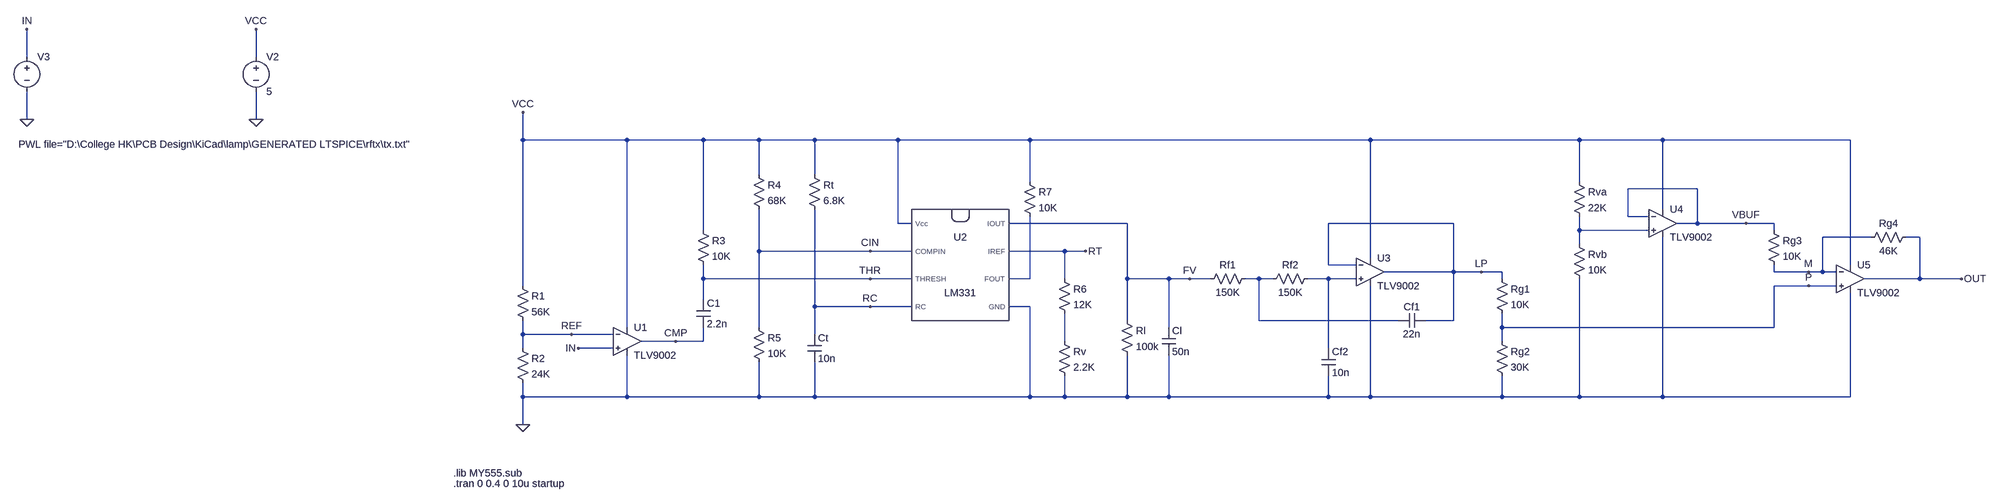
[diagram p0: schematic RX.asc]
RX.asc, the LTspice schematic file:
Version 4.1
SHEET 1 4120 680
WIRE -1040 -464 -1040 -528
WIRE -512 -464 -512 -528
WIRE -1040 -320 -1040 -384
WIRE -512 -320 -512 -384
WIRE 176 -272 176 -336
WIRE 416 -272 176 -272
WIRE 592 -272 416 -272
WIRE 720 -272 592 -272
WIRE 848 -272 720 -272
WIRE 1040 -272 848 -272
WIRE 1344 -272 1040 -272
WIRE 2128 -272 1344 -272
WIRE 2640 -272 2128 -272
WIRE 2832 -272 2640 -272
WIRE 3264 -272 2832 -272
WIRE 720 -192 720 -272
WIRE 848 -192 848 -272
WIRE 1344 -176 1344 -272
WIRE 2640 -176 2640 -272
WIRE 2912 -160 2752 -160
WIRE 2832 -112 2832 -272
WIRE 2752 -96 2752 -160
WIRE 2800 -96 2752 -96
WIRE 1040 -80 1040 -272
WIRE 1072 -80 1040 -80
WIRE 1568 -80 1296 -80
WIRE 2320 -80 2032 -80
WIRE 2912 -80 2912 -160
WIRE 2912 -80 2864 -80
WIRE 3024 -80 2912 -80
WIRE 3088 -80 3024 -80
WIRE 592 -64 592 -272
WIRE 2640 -64 2640 -96
WIRE 2800 -64 2640 -64
WIRE 3088 -64 3088 -80
WIRE 3312 -48 3200 -48
WIRE 3424 -48 3392 -48
WIRE 2640 -32 2640 -64
WIRE 720 -16 720 -112
WIRE 976 -16 720 -16
WIRE 1072 -16 976 -16
WIRE 1424 -16 1296 -16
WIRE 1472 -16 1424 -16
WIRE 2128 0 2128 -272
WIRE 2032 16 2032 -80
WIRE 2096 16 2032 16
WIRE 3264 16 3264 -272
WIRE 2320 32 2320 -80
WIRE 2320 32 2160 32
WIRE 2384 32 2320 32
WIRE 2432 32 2384 32
WIRE 3088 32 3088 16
WIRE 3168 32 3088 32
WIRE 3200 32 3200 -48
WIRE 3200 32 3168 32
WIRE 3232 32 3200 32
WIRE 592 48 592 16
WIRE 976 48 592 48
WIRE 1072 48 976 48
WIRE 1344 48 1344 -96
WIRE 1344 48 1296 48
WIRE 1424 48 1424 -16
WIRE 1568 48 1568 -80
WIRE 1664 48 1568 48
WIRE 1712 48 1664 48
WIRE 1760 48 1712 48
WIRE 1872 48 1840 48
WIRE 1904 48 1872 48
WIRE 2032 48 1984 48
WIRE 2096 48 2032 48
WIRE 2432 48 2432 32
WIRE 3424 48 3424 -48
WIRE 3424 48 3296 48
WIRE 3520 48 3424 48
WIRE 176 64 176 -272
WIRE 3168 64 3088 64
WIRE 3232 64 3168 64
WIRE 592 96 592 48
WIRE 848 112 848 -112
WIRE 976 112 848 112
WIRE 1072 112 976 112
WIRE 1344 112 1296 112
WIRE 1568 144 1568 48
WIRE 1872 144 1872 48
WIRE 2192 144 1872 144
WIRE 2320 144 2320 32
WIRE 2320 144 2256 144
WIRE 416 160 416 -272
WIRE 720 160 720 -16
WIRE 1664 160 1664 48
WIRE 2432 160 2432 128
WIRE 3088 160 3088 64
WIRE 3088 160 2432 160
WIRE 176 176 176 144
WIRE 288 176 176 176
WIRE 384 176 288 176
WIRE 848 176 848 112
WIRE 528 192 448 192
WIRE 592 192 592 160
WIRE 592 192 528 192
WIRE 1424 192 1424 128
WIRE 2432 192 2432 160
WIRE 176 208 176 176
WIRE 384 208 304 208
WIRE 2032 208 2032 48
WIRE 176 320 176 288
WIRE 416 320 416 224
WIRE 416 320 176 320
WIRE 720 320 720 240
WIRE 720 320 416 320
WIRE 848 320 848 240
WIRE 848 320 720 320
WIRE 1344 320 1344 112
WIRE 1344 320 848 320
WIRE 1424 320 1424 272
WIRE 1424 320 1344 320
WIRE 1568 320 1568 224
WIRE 1568 320 1424 320
WIRE 1664 320 1664 224
WIRE 1664 320 1568 320
WIRE 2032 320 2032 272
WIRE 2032 320 1664 320
WIRE 2128 320 2128 64
WIRE 2128 320 2032 320
WIRE 2432 320 2432 272
WIRE 2432 320 2128 320
WIRE 2640 320 2640 48
WIRE 2640 320 2432 320
WIRE 2832 320 2832 -48
WIRE 2832 320 2640 320
WIRE 3264 320 3264 80
WIRE 3264 320 2832 320
WIRE 176 384 176 320
FLAG -512 -528 VCC
FLAG -512 -320 0
FLAG 304 208 IN
FLAG 528 192 CMP
FLAG 176 -336 VCC
FLAG 176 384 0
FLAG 976 48 THR
FLAG 976 -16 CIN
FLAG 976 112 RC
FLAG 1472 -16 RT
FLAG 1712 48 FV
FLAG 288 176 REF
FLAG 2384 32 LP
FLAG 3024 -80 VBUF
FLAG 3168 64 P
FLAG 3168 32 M
FLAG 3520 48 OUT
FLAG -1040 -528 IN
FLAG -1040 -320 0
SYMBOL OpAmps\\TLV9002 416 128 R0
SYMATTR InstName U1
SYMBOL voltage -512 -480 R0
WINDOW 123 0 0 Left 0
WINDOW 39 0 0 Left 0
SYMATTR InstName V2
SYMATTR Value 5
SYMBOL res 160 48 R0
SYMATTR InstName R1
SYMATTR Value 56K
SYMBOL res 160 192 R0
SYMATTR InstName R2
SYMATTR Value 24K
SYMBOL cap 576 96 R0
SYMATTR InstName C1
SYMATTR Value 2.2n
SYMBOL res 576 -80 R0
SYMATTR InstName R3
SYMATTR Value 10K
SYMBOL res 704 -208 R0
SYMATTR InstName R4
SYMATTR Value 68K
SYMBOL res 704 144 R0
SYMATTR InstName R5
SYMATTR Value 10K
SYMBOL LM331 1184 16 M0
SYMATTR InstName U2
SYMBOL res 832 -208 R0
SYMATTR InstName Rt
SYMATTR Value 6.8K
SYMBOL cap 832 176 R0
SYMATTR InstName Ct
SYMATTR Value 10n
SYMBOL res 1328 -192 R0
SYMATTR InstName R7
SYMATTR Value 10K
SYMBOL res 1552 128 R0
SYMATTR InstName Rl
SYMATTR Value 100k
SYMBOL cap 1648 160 R0
SYMATTR InstName Cl
SYMATTR Value 50n
SYMBOL res 1408 32 R0
SYMATTR InstName R6
SYMATTR Value 12K
SYMBOL res 1408 176 R0
SYMATTR InstName Rv
SYMATTR Value 2.2K
SYMBOL res 1856 32 R90
WINDOW 0 0 56 VBottom 2
WINDOW 3 32 56 VTop 2
SYMATTR InstName Rf1
SYMATTR Value 150K
SYMBOL res 2000 32 R90
WINDOW 0 0 56 VBottom 2
WINDOW 3 32 56 VTop 2
SYMATTR InstName Rf2
SYMATTR Value 150K
SYMBOL OpAmps\\TLV9002 2128 -32 R0
SYMATTR InstName U3
SYMBOL cap 2016 208 R0
SYMATTR InstName Cf2
SYMATTR Value 10n
SYMBOL cap 2256 128 R90
WINDOW 0 0 32 VBottom 2
WINDOW 3 32 32 VTop 2
SYMATTR InstName Cf1
SYMATTR Value 22n
SYMBOL OpAmps\\TLV9002 2832 -144 R0
SYMATTR InstName U4
SYMBOL res 2624 -192 R0
SYMATTR InstName Rva
SYMATTR Value 22K
SYMBOL res 2624 -48 R0
SYMATTR InstName Rvb
SYMATTR Value 10K
SYMBOL OpAmps\\TLV9002 3264 -16 R0
SYMATTR InstName U5
SYMBOL res 2416 32 R0
SYMATTR InstName Rg1
SYMATTR Value 10K
SYMBOL res 2416 176 R0
SYMATTR InstName Rg2
SYMATTR Value 30K
SYMBOL res 3408 -64 R90
WINDOW 0 0 56 VBottom 2
WINDOW 3 32 56 VTop 2
SYMATTR InstName Rg4
SYMATTR Value 46K
SYMBOL res 3072 -80 R0
SYMATTR InstName Rg3
SYMATTR Value 10K
SYMBOL voltage -1040 -480 R0
WINDOW 3 -19 218 Left 2
WINDOW 123 0 0 Left 0
WINDOW 39 0 0 Left 0
SYMATTR InstName V3
SYMATTR Value PWL file="D:\College HK\PCB Design\KiCad\lamp\GENERATED LTSPICE\rftx\tx.txt"
TEXT 16 520 Left 2 !.tran 0 0.4 0 10u startup
TEXT 16 496 Left 2 !.lib MY555.sub

The netlist it stands for:
* RX.asc
X§U1 IN REF VCC 0 CMP TLV9002  ; pins In+ In- V+ V- OUT
V2 VCC 0 5
R1 VCC REF 56K
R2 REF 0 24K
C1 THR CMP 2.2n
R3 VCC THR 10K
R4 VCC CIN 68K
R5 CIN 0 10K
X§U2 FV RT N002 0 RC THR CIN VCC LM331  ; pins IOUT IREF FOUT GND RC THRESH COMPIN Vcc
Rt VCC RC 6.8K
Ct RC 0 10n
R7 VCC N002 10K
Rl FV 0 100k
Cl FV 0 50n
R6 RT N005 12K
Rv N005 0 2.2K
Rf1 N003 FV 150K
Rf2 N004 N003 150K
X§U3 N004 LP VCC 0 LP TLV9002  ; pins In+ In- V+ V- OUT
Cf2 N004 0 10n
Cf1 LP N003 22n
X§U4 N001 VBUF VCC 0 VBUF TLV9002  ; pins In+ In- V+ V- OUT
Rva VCC N001 22K
Rvb N001 0 10K
X§U5 P M VCC 0 OUT TLV9002  ; pins In+ In- V+ V- OUT
Rg1 LP P 10K
Rg2 P 0 30K
Rg4 OUT M 46K
Rg3 VBUF M 10K
V3 IN 0 PWL file="D:\College HK\PCB Design\KiCad\lamp\GENERATED LTSPICE\rftx\tx.txt"
.tran 0 0.4 0 10u startup
.lib MY555.sub
.lib LM331.sub
.backanno
.end